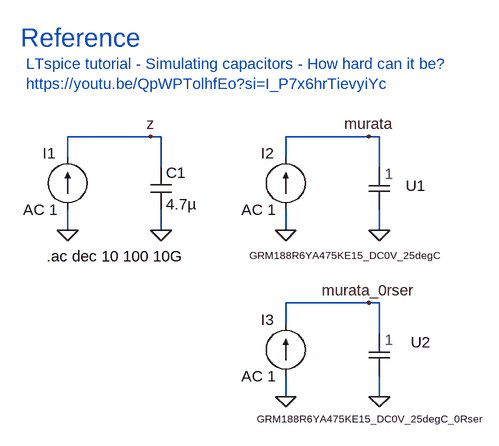
[diagram p0: schematic 04-GRM188R6YA475KE15_impedance.asc]
04-GRM188R6YA475KE15_impedance.asc, the LTspice schematic file:
Version 4
SHEET 1 944 680
WIRE 208 80 80 80
WIRE 224 80 208 80
WIRE 544 80 416 80
WIRE 560 80 544 80
WIRE 80 112 80 80
WIRE 416 112 416 80
WIRE 224 128 224 80
WIRE 560 128 560 80
WIRE 80 224 80 192
WIRE 224 224 224 192
WIRE 416 224 416 192
WIRE 560 224 560 192
WIRE 544 336 416 336
WIRE 560 336 544 336
WIRE 416 368 416 336
WIRE 560 384 560 336
WIRE 416 480 416 448
WIRE 560 480 560 448
FLAG 80 224 0
FLAG 224 224 0
FLAG 208 80 z
FLAG 416 224 0
FLAG 560 224 0
FLAG 544 80 murata
FLAG 416 480 0
FLAG 560 480 0
FLAG 544 336 murata_0rser
SYMBOL current 80 192 R180
WINDOW 0 18 86 Left 2
WINDOW 3 24 0 Left 2
WINDOW 123 15 -1 Left 2
WINDOW 39 0 0 Left 0
SYMATTR InstName I1
SYMATTR Value ""
SYMATTR Value2 AC 1
SYMBOL cap 208 128 R0
SYMATTR InstName C1
SYMATTR Value 4.7µ
SYMATTR SpiceLine Rser=6m Lser=270p
SYMBOL current 416 192 R180
WINDOW 0 18 86 Left 2
WINDOW 3 24 0 Left 2
WINDOW 123 15 -1 Left 2
WINDOW 39 0 0 Left 0
SYMATTR InstName I2
SYMATTR Value ""
SYMATTR Value2 AC 1
SYMBOL GRM188R6YA475KE15_DC0V_25degC 560 128 R0
WINDOW 3 -55 124 Top 1
SYMATTR InstName U1
SYMBOL current 416 448 R180
WINDOW 0 18 86 Left 2
WINDOW 3 24 0 Left 2
WINDOW 123 15 -1 Left 2
WINDOW 39 0 0 Left 0
SYMATTR InstName I3
SYMATTR Value ""
SYMATTR Value2 AC 1
SYMBOL GRM188R6YA475KE15_DC0V_25degC_0Rser 560 384 R0
WINDOW 3 -18 120 Top 1
SYMATTR InstName U2
TEXT 48 264 Left 2 !.ac dec 10 100 10G
TEXT 16 -32 Left 2 ;LTspice tutorial - Simulating capacitors - How hard can it be?\nhttps://youtu.be/QpWPTolhfEo?si=I_P7x6hrTievyiYc
TEXT 8 -72 Left 4 ;Reference

The netlist it stands for:
* 04-GRM188R6YA475KE15_impedance.asc
I1 0 z AC 1
C1 z 0 4.7µ Rser=6m Lser=270p
I2 0 murata AC 1
XU1 murata 0 GRM188R6YA475KE15_DC0V_25degC  ; pins port1 port2
I3 0 murata_0rser AC 1
XU2 murata_0rser 0 GRM188R6YA475KE15_DC0V_25degC_0Rser  ; pins port1 port2
.ac dec 10 100 10G
* LTspice tutorial - Simulating capacitors - How hard can it be?
* https://youtu.be/QpWPTolhfEo?si=I_P7x6hrTievyiYc
* Reference
.lib C:\Users\s\Documents\GitHub\LTspice\12-capacitors\GRM188R6YA475KE15_DC0V_25degC.mod
.lib C:\Users\s\Documents\GitHub\LTspice\12-capacitors\GRM188R6YA475KE15_Rser_0.mod
.backanno
.end

* Results of the author's LTspice run, read from the files saved beside the schematic
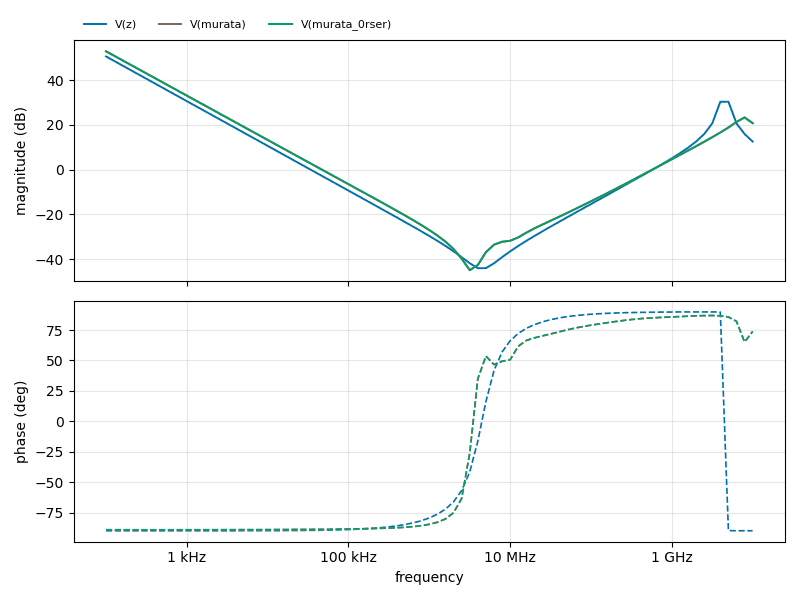
[diagram p1: AC Analysis of 04-GRM188R6YA475KE15_impedance.asc, plotted from the saved traces]
* AC Analysis, 1 run:
*   V(z): 50.59 dB at 100 Hz, 12.53 dB at 10 GHz, peak 50.59 dB at 100 Hz, 3 dB below the peak at 141.4 Hz
*   V(murata): 52.89 dB at 100 Hz, 20.75 dB at 10 GHz, peak 52.89 dB at 100 Hz, 3 dB below the peak at 141.9 Hz
*   V(murata_0rser): 52.89 dB at 100 Hz, 20.75 dB at 10 GHz, peak 52.89 dB at 100 Hz, 3 dB below the peak at 141.9 Hz